# EAGLE design POT_1_0 (EAGLE 8.3.2)
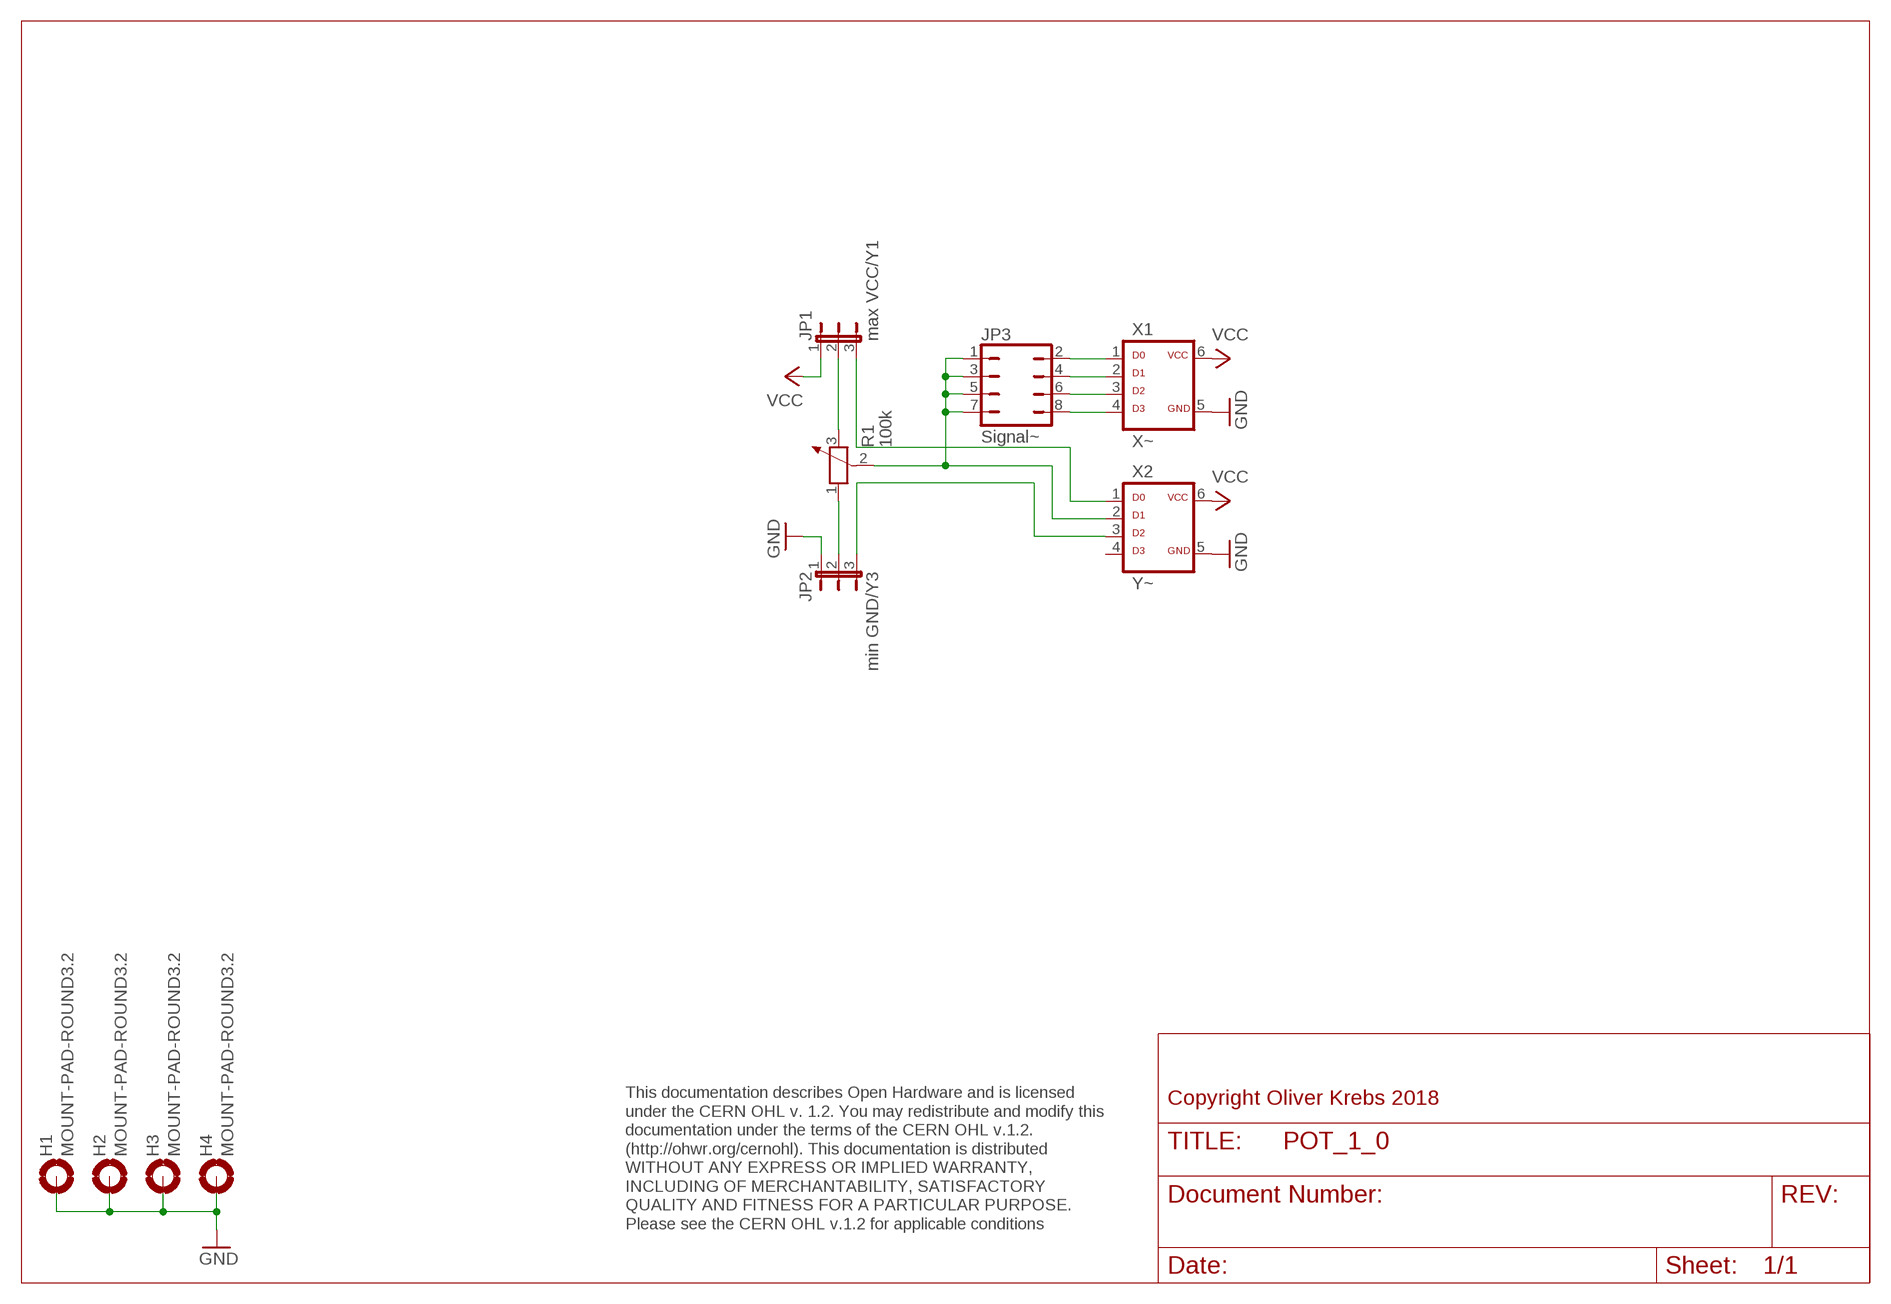
[diagram p0: schematic, sheet 1]

## Parts
H1  MOUNT-PAD-ROUND3.2  [3,2-PAD]
H2  MOUNT-PAD-ROUND3.2  [3,2-PAD]
H3  MOUNT-PAD-ROUND3.2  [3,2-PAD]
H4  MOUNT-PAD-ROUND3.2  [3,2-PAD]
JP1  max VCC/Y1  JP2EJP2-U  [JP2-U]
JP2  min GND/Y3  JP2EJP2-U  [JP2-U]
JP3  Signal~  JP4Q  [JP4Q]
R1  100k  POTENTIOMETER_RK09K113  [RK09K113]
X1  X~  ML6D  [ML-6]
X2  Y~  ML6D  [ML-6]

## Nets
GND: H1.B3,2(MOUNT) H2.B3,2(MOUNT) H3.B3,2(MOUNT) H4.B3,2(MOUNT) JP2.1 X1.5 X2.5
N$1: JP3.2 X1.1
N$2: JP1.3 X2.1
N$3: JP2.3 X2.3
N$4: JP3.4 X1.2
N$5: JP1.2 R1.3
N$6: JP2.2 R1.1
N$7: JP3.6 X1.3
N$8: JP3.8 X1.4
N$9: JP3.1 JP3.3 JP3.5 JP3.7 R1.2 X2.2
VCC: JP1.1 X1.6 X2.6
Unconnected: X2.4

## Notes on the sheet
- Copyright Oliver Krebs 2018
- This documentation describes Open Hardware and is licensed 
  under the CERN OHL v. 1.2. You may redistribute and modify this 
  documentation under the terms of the CERN OHL v.1.2. 
  (http://ohwr.org/cernohl). This documentation is distributed
  WITHOUT ANY EXPRESS OR IMPLIED WARRANTY, 
  INCLUDING OF MERCHANTABILITY, SATISFACTORY 
  QUALITY AND FITNESS FOR A PARTICULAR PURPOSE. 
  Please see the CERN OHL v.1.2 for applicable conditions

## Library data of the parts
H1-H4 = holes:MOUNT-PAD-ROUND: MOUNTING PAD, round
JP1 JP2 = 01-my-jumper:JP2E: JUMPER
JP3 = 01-my-jumper:JP4Q: JUMPER
R1 = 01-my_rcl:POTENTIOMETER_: Potentiometer ALPS RK09K113
X1 X2 = 01-my-con:ML6D

## Board
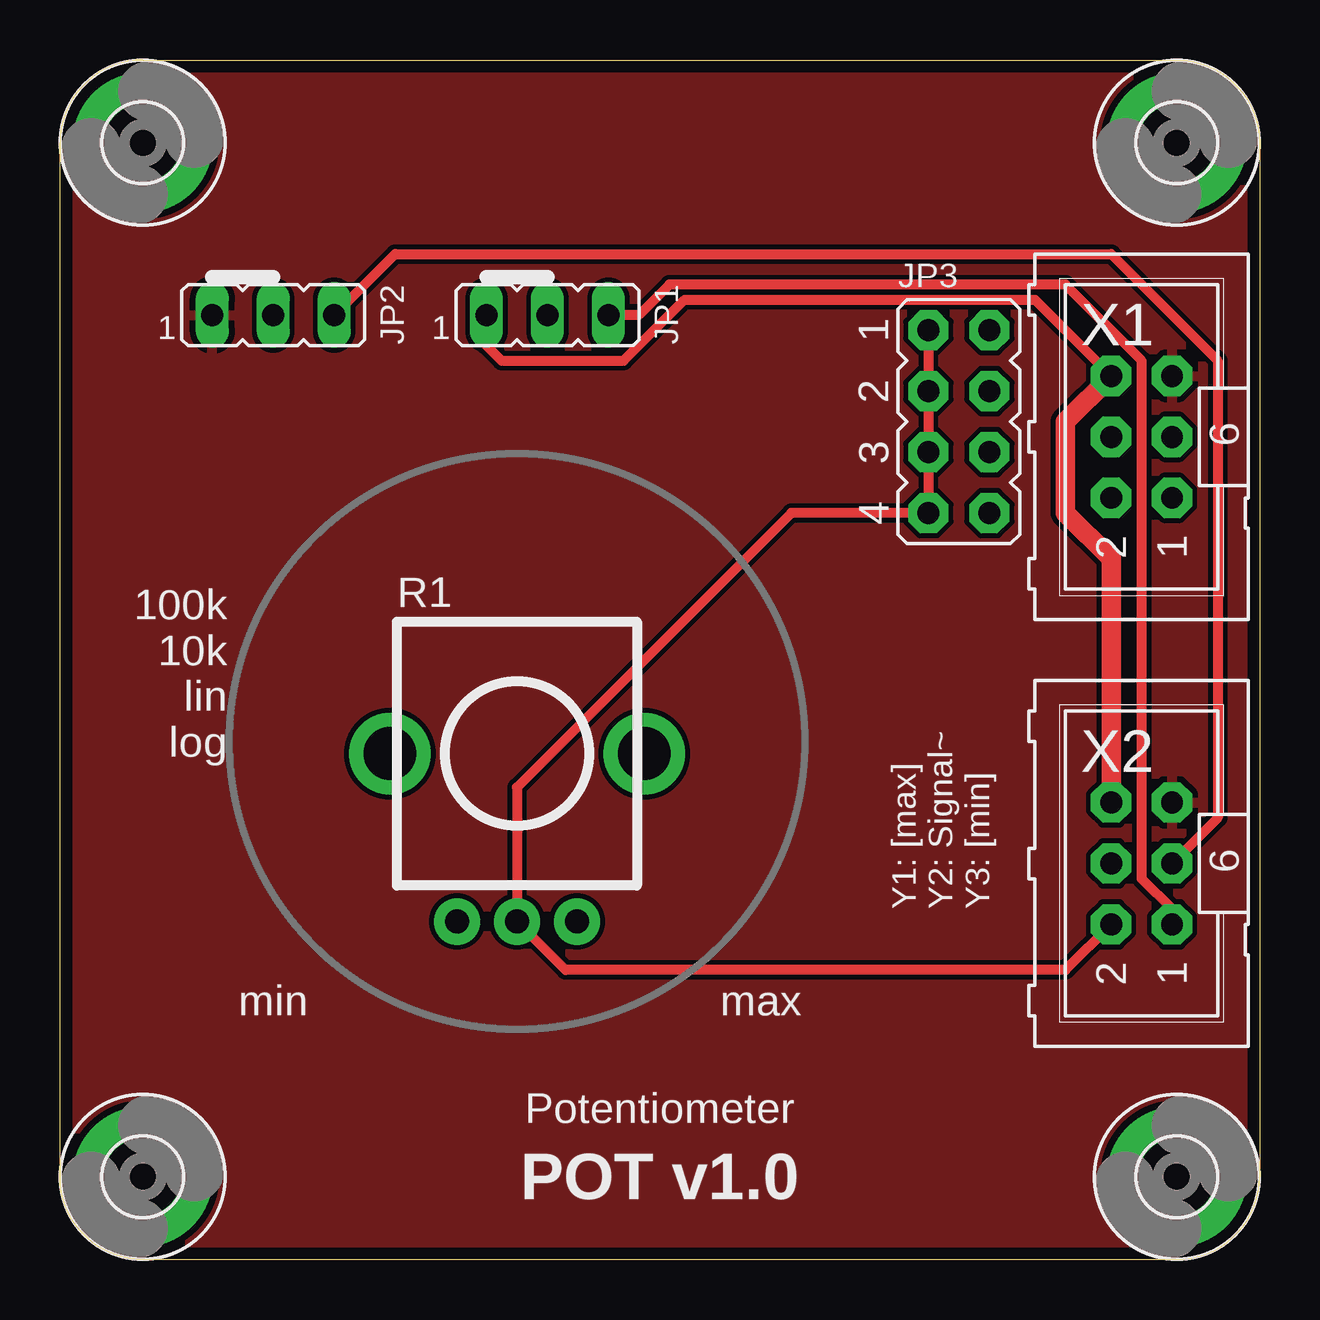
[diagram p1: board, top side]
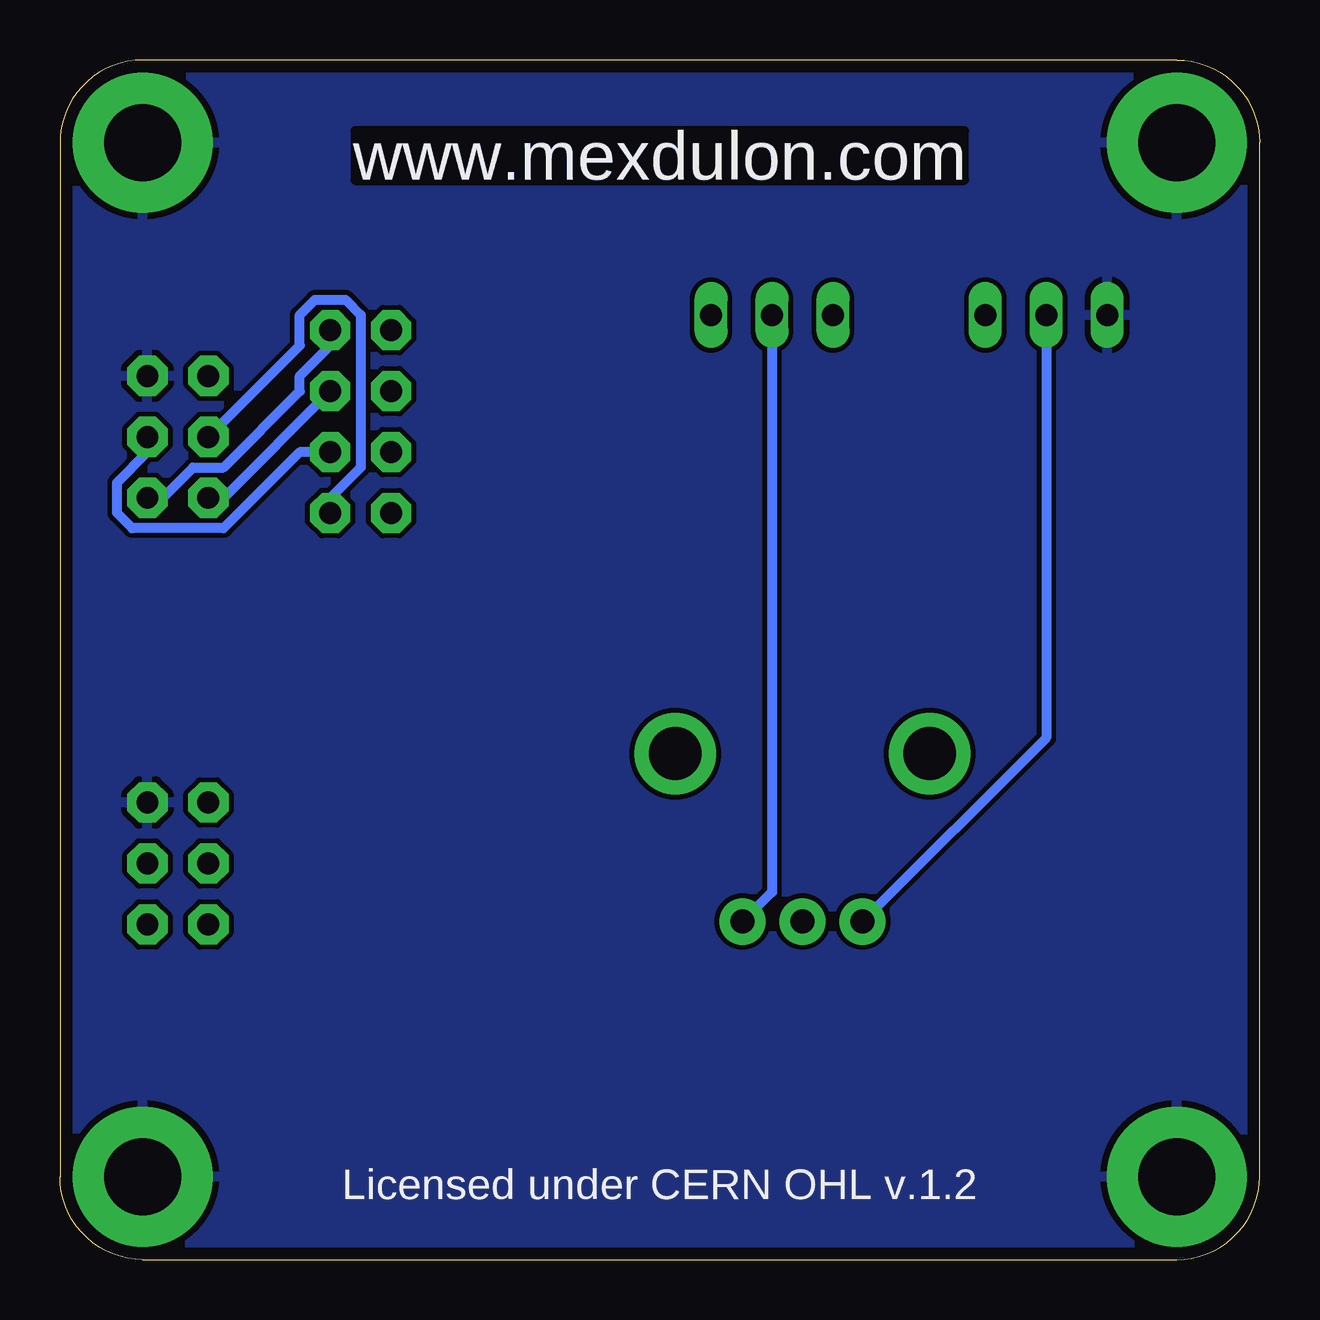
[diagram p2: board, bottom side, seen from below]

Size 50 x 50 mm. Coordinates in mm from the lower left corner, seen from the top.
Outline: 0,3.45 0,46.55 arc-90 3.45,50 46.55,50 arc-90 50,46.55 50,3.45 arc-90 46.55,0 3.45,0 arc-90 0,3.45
Copper layers (1*16): Top 0.035mm / dielectric 1.6mm / Bottom 0.035mm
Design rules "Elecrow_2-layer_PCB_eagle_rule_8mil *": minimum track width 8mil, minimum drill 12mil, track to track 8mil, track to pad 8mil, pad to pad 8mil, via to via 8mil, smd to smd 0mil, copper to edge 20mil, drill to drill 10mil, minimum pad ring 6mil, minimum via ring 6mil, stop-mask expansion 0mil, vias tented up to drill 100mil, thermal gap 10mil

### Footprints (pad centres in the part's own frame; a part is rotated, then mirrored left to right if it is on the bottom)
3,2-PAD = drill 3.2 pad 5.842: B3,2 0,0
JP2-U = drill 0.914 long: 1 -2.54,0; 2 0,0; 3 2.54,0
JP4Q = drill 0.914 pad 1.676 octagon: 1 -3.81,-1.27; 2 -3.81,1.27; 3 -1.27,-1.27; 4 -1.27,1.27; 5 1.27,-1.27; 6 1.27,1.27; 7 3.81,-1.27; 8 3.81,1.27
RK09K113 = drill 1 pad 1.93: 1 -2.5,-7.5; 2 0,-7.5; 3 2.5,-7.5 | drill 2.2 pad 3.4: 4 -5.3,-0.5; 5 5.3,-0.5
ML-6 = drill 0.914 pad 1.676 octagon: 1 -2.54,-1.27; 2 -2.54,1.27; 3 0,-1.27; 4 0,1.27; 5 2.54,-1.27; 6 2.54,1.27

### Placement (x,y rotation side)
H1  3.45,3.45 0 top
H2  3.45,46.55 0 top
H3  46.55,46.55 0 top
H4  46.55,3.45 0 top
JP1  20.32,39.37 0 top
JP2  8.89,39.37 0 top
JP3  37.47,34.92 270 top
R1  19.05,21.59 0 top
X1  45.09,34.29 90 top
X2  45.09,16.51 90 top

### Tracks (layer width: path | path; a pad name or v marks a point on that pad's centre or on a via)
GND
  pour Bottom (isolate 0.203): 0,50.16 50.8,50.16 50.8,0 0,0
  pour Top (isolate 0.203): 0,50.16 50.8,50.16 50.8,0 0,0
N$1
  Bottom 0.406: X1.1 45.72,31.75 44.45,33.02 43.18,33.02 40.01,36.2 40.01,36.83 38.73,38.1 JP3.2
N$2
  Top 0.406: X2.1 46.35,14.61 45.09,15.88 45.09,37.47 41.91,40.64 25.4,40.64 24.13,39.37 JP1.3
N$3
  Top 0.406: JP2.3 13.97,41.91 43.81,41.91 48.26,37.47 48.26,18.41 X2.3
N$4
  Bottom 0.406: JP3.4 43.18,31.75 X1.2
N$5
  Bottom 0.406: JP1.2 20.32,15.32 R1.3
N$6
  Bottom 0.406: JP2.2 8.89,21.75 R1.1
N$7
  Bottom 0.406: JP3.6 40.01,33.66 43.18,30.48 46.99,30.48 47.62,31.11 47.62,32.38 46.35,33.66 X1.3
N$8
  Bottom 0.406: JP3.8 38.73,31.75 37.47,33.02 37.47,39.37 38.1,40.01 39.37,40.01 40.01,39.37 40.01,38.1 X1.4
N$9
  Top 0.406: X2.2 41.91,12.06 21.07,12.06 R1.2 19.05,19.68 30.48,31.11 JP3.7 JP3.5 JP3.3 JP3.1
VCC
  Top 0.406: JP1.1 17.78,38.1 18.41,37.47 23.5,37.47 26.04,40.01 40.64,40.01 X1.6
  Top 0.813: X1.6 41.91,34.92 41.91,31.11 43.81,29.21 X2.6

### Text on the board
Bottom: www.mexdulon.com
tNames: 100k / 10k / lin / log | Y1: [max] / Y2: Signal~ / Y3: [min] | min | max | Potentiometer | POT v1.0
bNames: www.mexdulon.com | Licensed under CERN OHL v.1.2
200bmp: E:/Bilder/Elektronik/Modulion/Mexdulon/mexdulon_50x50_pcb.bmp